# EAGLE design Enclosure 110x110 SWT (EAGLE 9.6.2)
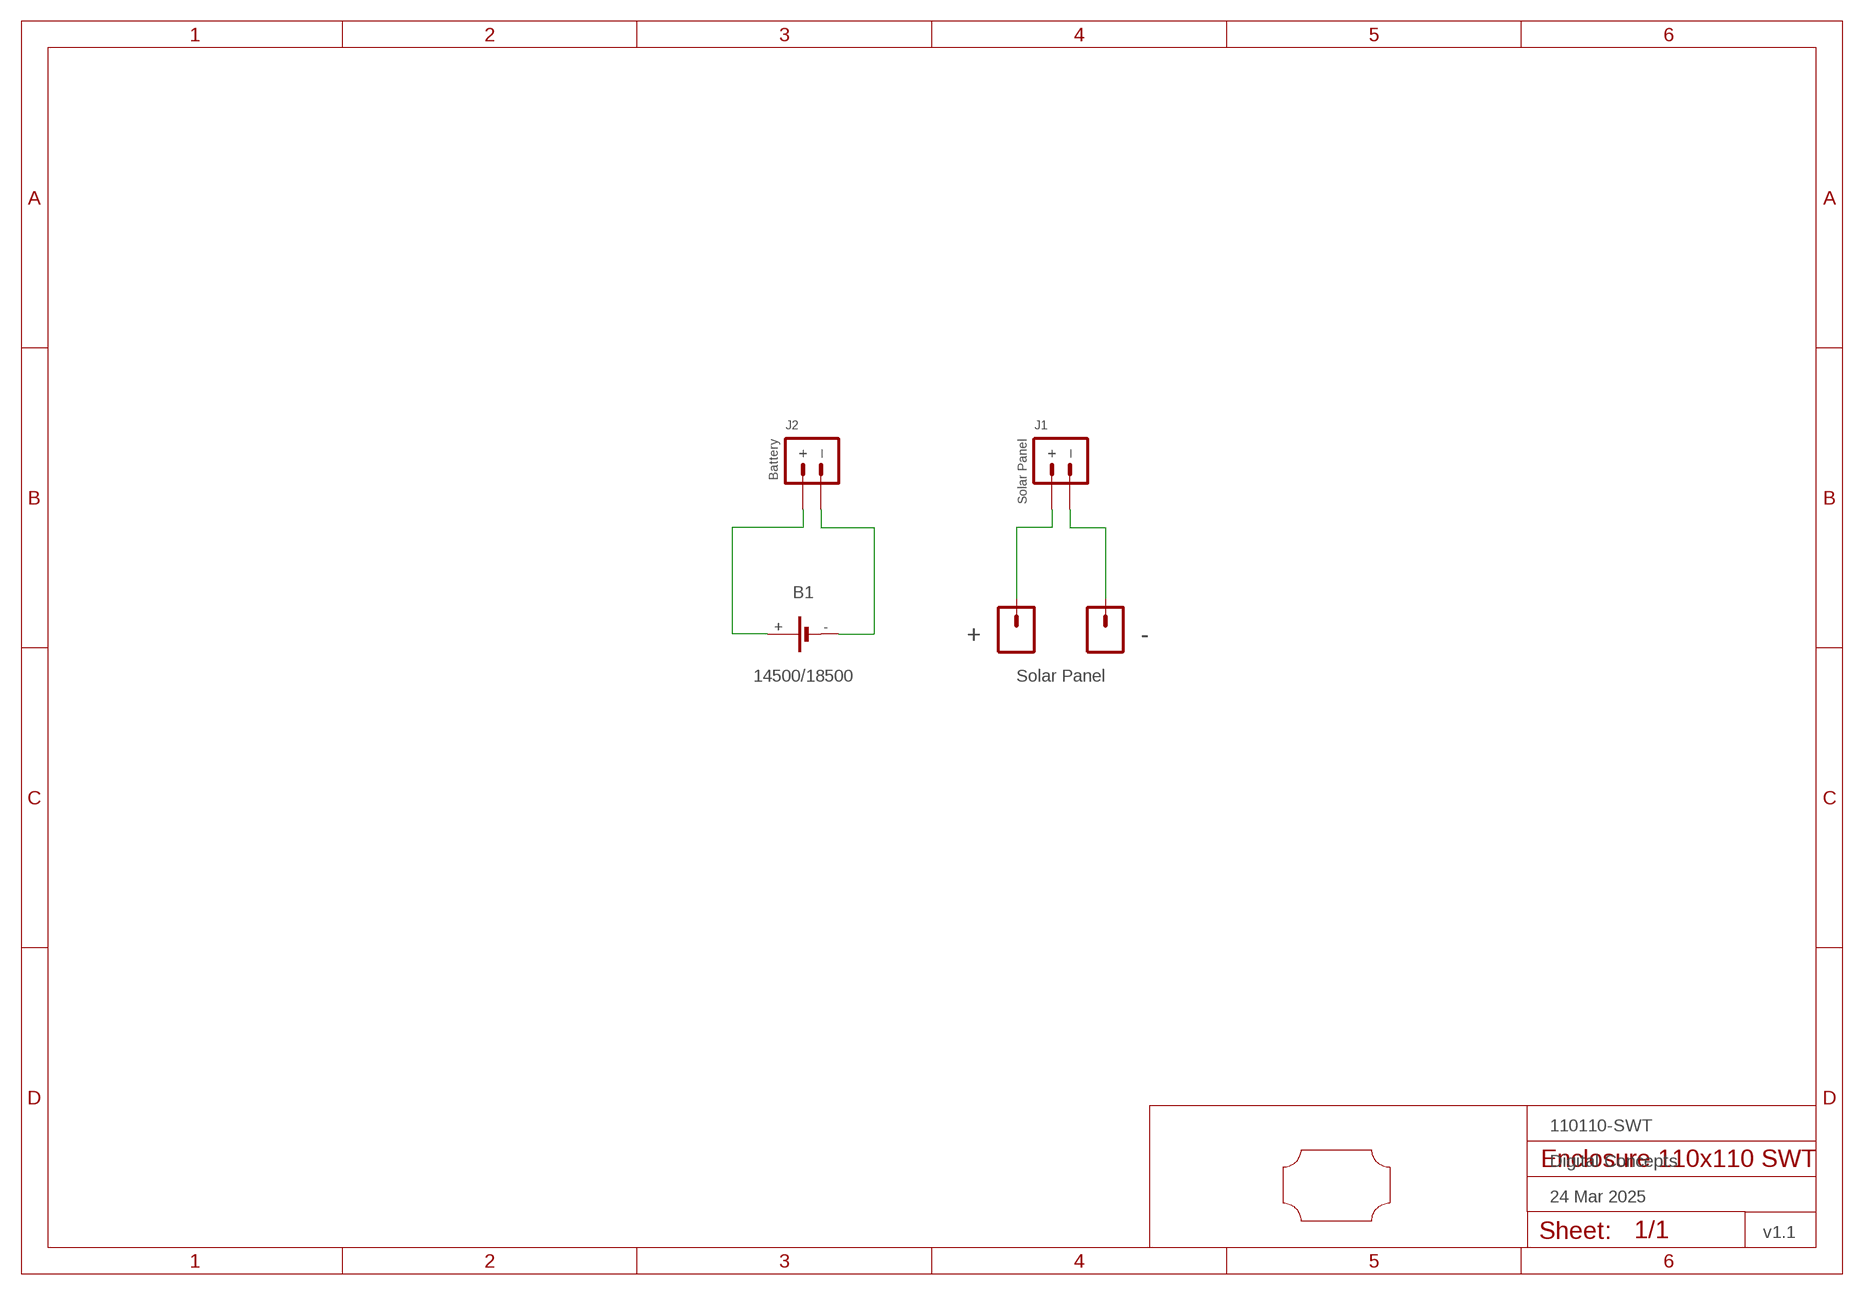
[diagram p0: schematic, sheet 1]
FRAME1 (FRAME-A4L-LOC): DATE: 24 Mar 2025; OWNER: Digital Concepts; TITLE: 110110-SWT; VERSION: v1.1

## Parts
+  PAD-SMD-GENERIC-SQUARE  [PAD-SMD-GENERIC]
-  PAD-SMD-GENERIC-SQUARE  [PAD-SMD-GENERIC]
B1  14500/18500  BATTERY-HOLDER-14500/18500  [BATTERY-14500/18500]
J1  Solar Panel  JST-PH2.0-2-HORIZONTAL-POWERJST-PTH-2  [JST-PH2.0-2-HORIZONTAL-POWER]
J2  Battery  JST-PH2.0-2-HORIZONTAL-POWERJST-PTH-2  [JST-PH2.0-2-HORIZONTAL-POWER]
U$1  PCB-OUTLINE-110X110  [PROTO-110X110-OUTLINE]

## Nets
N$1: B1.+ J2.+
N$2: B1.- J2.-(–)
N$3: +.P$1 J1.+
N$4: -.P$1 J1.-(–)

## Notes on the sheet
- Solar Panel

## Library data of the parts
+ - = digitalconcepts:PAD-SMD-GENERIC-SQUARE: SMD Pad—Square
B1 = digitalconcepts:BATTERY-HOLDER-14500/18500: 14500/18500 Battery Holder
J1 J2 = digitalconcepts:JST-PH2.0-2-HORIZONTAL-POWER: PH2.0 2P Right Angle PCB Connector; PROD_ID: CONN-09863; SKU: PRT-09914
U$1 = digitalconcepts:PCB-OUTLINE-110X110: PCB outline for 110 x 110 enclosure (100x80 max)

## Board
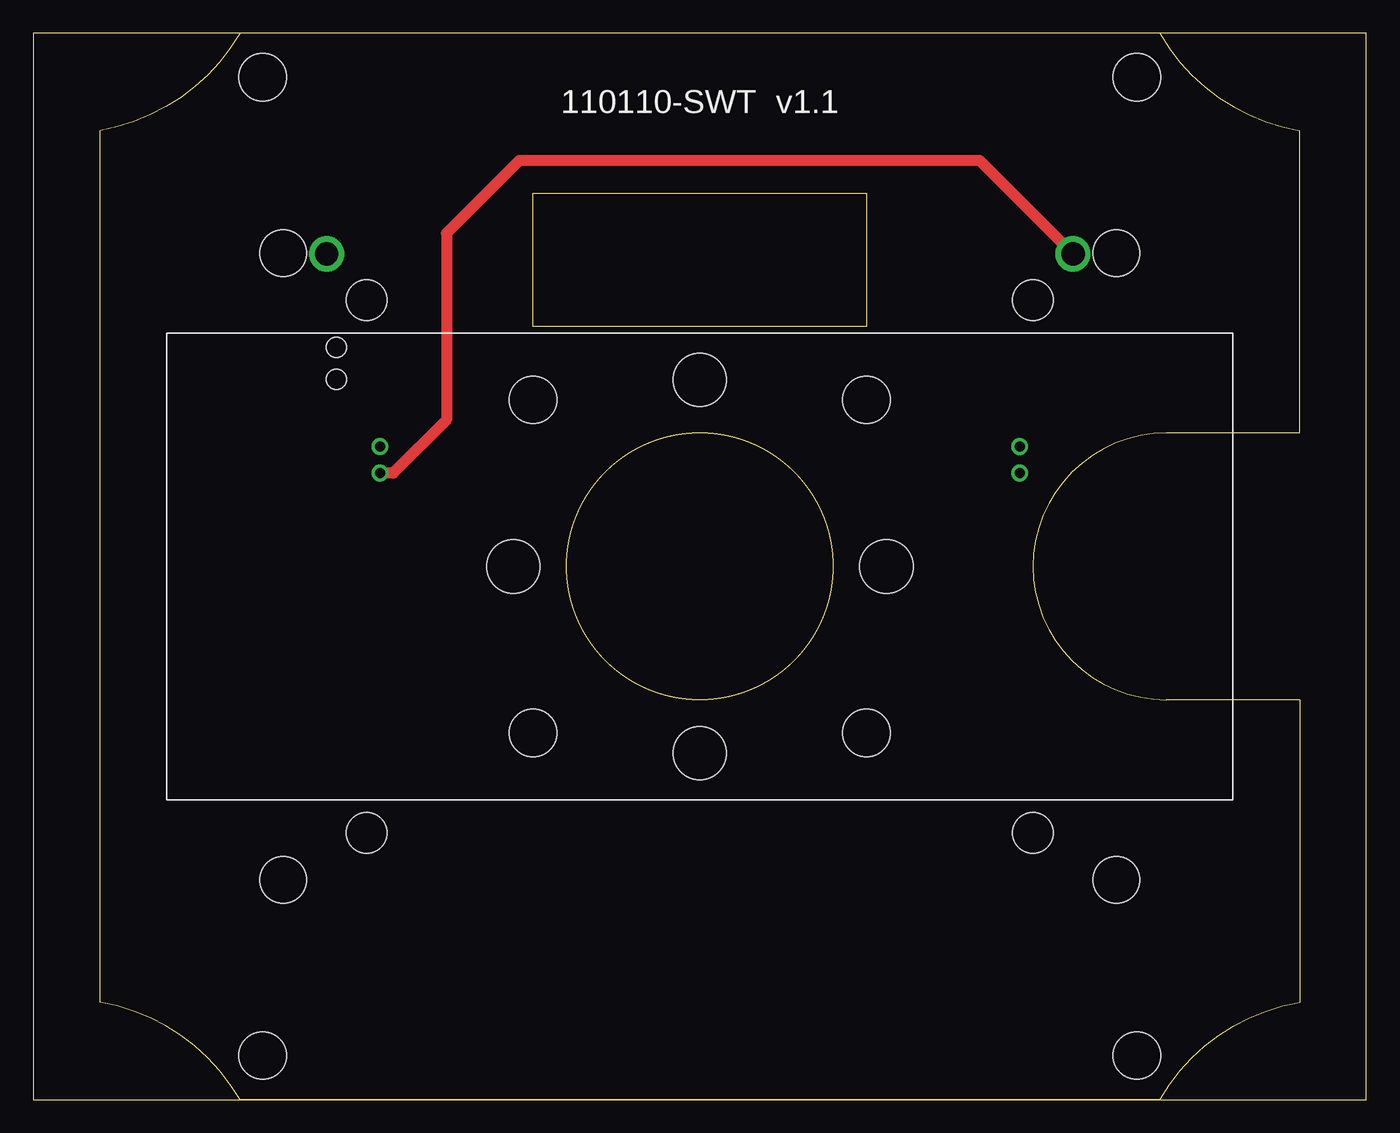
[diagram p1: board, top side]
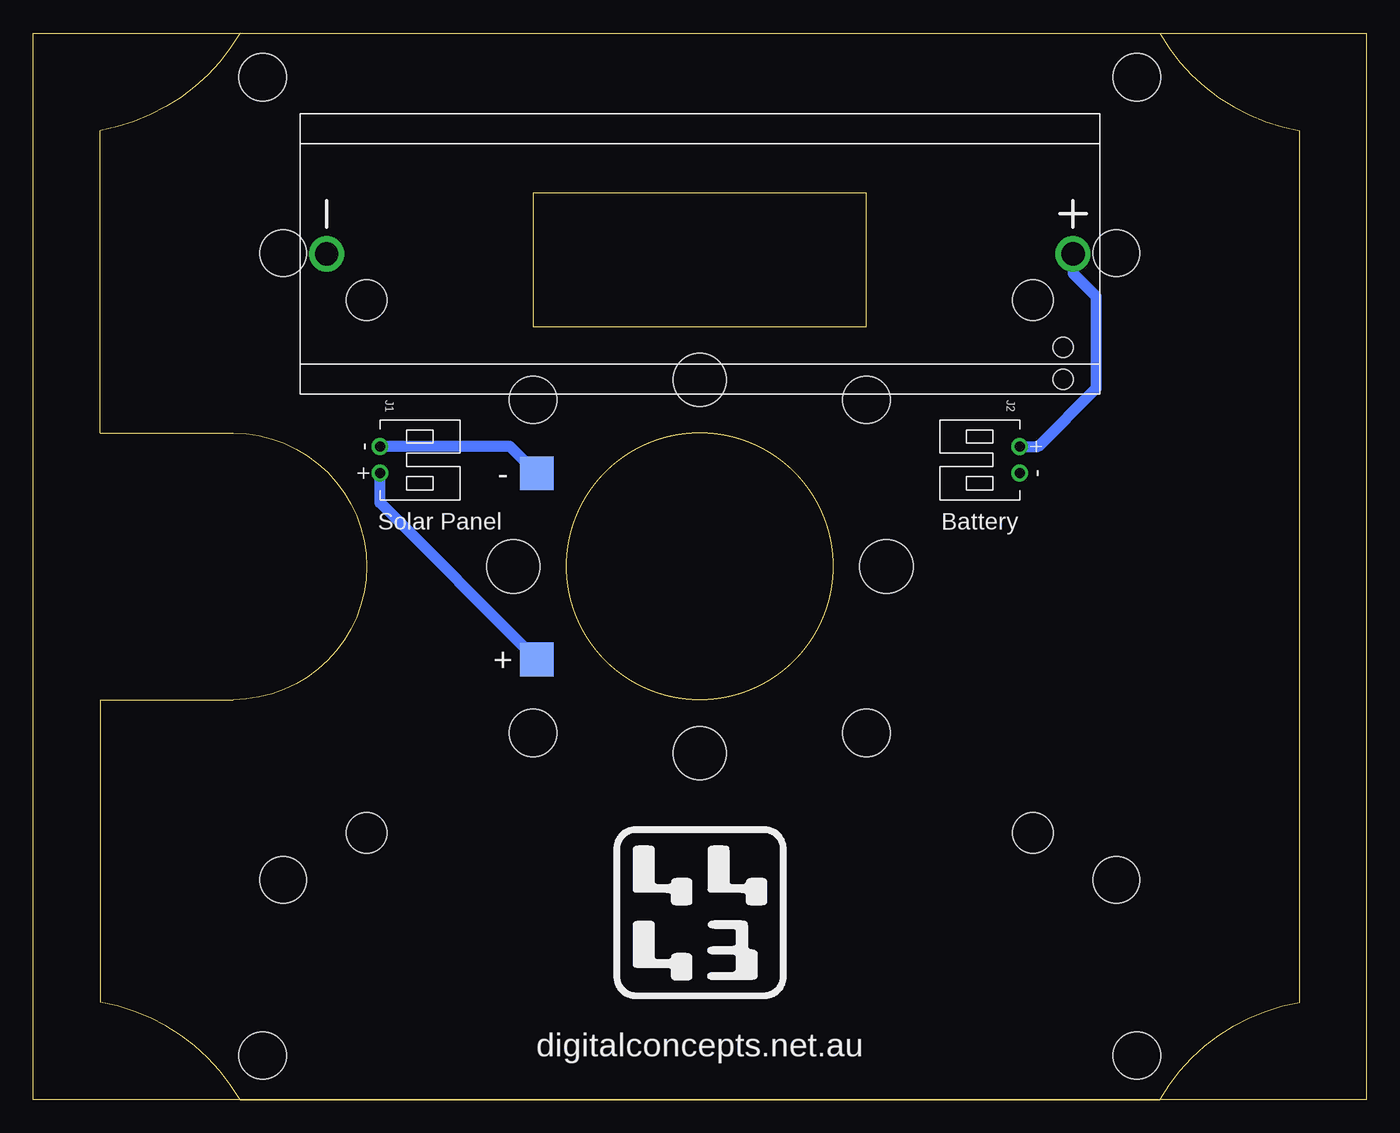
[diagram p2: board, bottom side, seen from below]

Size 100 x 80 mm. Coordinates in mm from the lower left corner, seen from the top.
Outline: 0,0 100,0 100,80 0,80 0,0
Outline: 37.5,68 62.5,68 62.5,58 37.5,58 37.5,68
Outline: circle at 50,40 radius 10
Copper layers (1*16): Top 0.035mm / dielectric 1.5mm / Bottom 0.035mm
Design rules "default *": minimum track width 6mil, minimum drill 0.35mm, track to track 6mil, track to pad 6mil, pad to pad 6mil, via to via 6mil, smd to smd 6mil, copper to edge 6mil, drill to drill 6mil, minimum pad ring 10mil, minimum via ring 8mil, stop-mask expansion 4mil, vias tented up to drill 0mil, thermal gap 10mil

### Footprints (pad centres in the part's own frame; a part is rotated, then mirrored left to right if it is on the bottom)
PAD-SMD-GENERIC = smd 2.54 x 2.54: P$1 0,0
BATTERY-14500/18500 = drill 1.75: + -28,0; - 28,0 | hole 1.524: -27.25,9.4; -27.25,7
JST-PH2.0-2-HORIZONTAL-POWER = drill 0.75: + 1,0; - -1,0
PROTO-110X110-OUTLINE = hole 3.556: -12.5,12.5; -12.5,-12.5; 12.5,-12.5; 12.5,12.5; -32.8,36.7; 32.8,36.7; 32.8,-36.7; -32.8,-36.7 | hole 3.048: -24.994,19.99; 24.994,19.99; 24.994,-19.99; -24.994,-19.99 | hole 3.5: -31.25,23.5; 31.25,23.5; 31.25,-23.5; -31.25,-23.5 | hole 4: 0,14; 0,-14; 14,0; -14,0

### Placement (x,y rotation side)
+  62.23,33.02 0 bottom
-  62.23,46.99 0 bottom
B1  50,63.45 180 bottom
J1  74,48 270 bottom
J2  26,48 90 bottom
U$1  50,40 0 top

### Tracks (layer width: path | path; a pad name or v marks a point on that pad's centre or on a via)
N$1
  Bottom 0.813: J2.+ 24.6,49 20.27,53.33 20.27,60.27 22,62 B1.+
N$2
  Top 0.813: B1.- 71,70.45 36.45,70.45 31,65 31,51 27,47 J2.-
N$3
  Bottom 0.813: +.P$1 74,44.79 J1.+
N$4
  Bottom 0.813: -.P$1 64.24,49 J1.-

### Text on the board
tPlace: 110110-SWT v1.1
bPlace: digitalconcepts.net.au